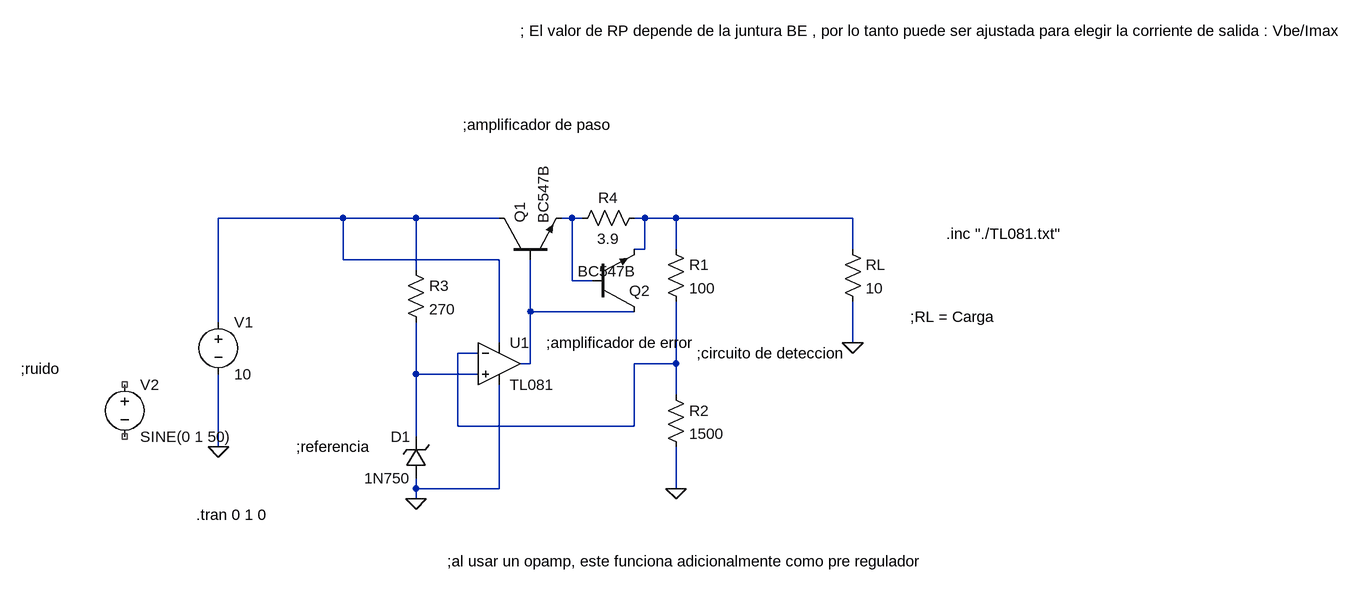
[diagram p0: schematic Fuente.asc]
Fuente.asc, the LTspice schematic file:
Version 4
SHEET 1 1444 680
WIRE -160 -48 -352 -48
WIRE -48 -48 -160 -48
WIRE 80 -48 -48 -48
WIRE 192 -48 176 -48
WIRE 208 -48 192 -48
WIRE 304 -48 288 -48
WIRE 352 -48 304 -48
WIRE 624 -48 352 -48
WIRE 304 0 304 -48
WIRE 304 0 288 0
WIRE 352 0 352 -48
WIRE 624 0 624 -48
WIRE -160 16 -160 -48
WIRE 80 16 -160 16
WIRE -48 32 -48 -48
WIRE 192 48 192 -48
WIRE 224 48 192 48
WIRE 128 96 128 16
WIRE 288 96 128 96
WIRE -352 112 -352 -48
WIRE 80 144 80 16
WIRE 624 144 624 80
WIRE 48 160 16 160
WIRE 128 176 128 96
WIRE 128 176 112 176
WIRE 352 176 352 80
WIRE 352 176 288 176
WIRE -48 192 -48 112
WIRE 48 192 -48 192
WIRE 352 224 352 176
WIRE 16 272 16 160
WIRE 288 272 288 176
WIRE 288 272 16 272
WIRE -48 288 -48 192
WIRE -352 304 -352 192
WIRE -48 368 -48 352
WIRE 80 368 80 208
WIRE 80 368 -48 368
WIRE 352 368 352 304
WIRE -48 384 -48 368
FLAG -352 304 0
FLAG -48 384 0
FLAG 352 368 0
FLAG 624 144 0
SYMBOL npn 80 16 R270
SYMATTR InstName Q1
SYMATTR Value BC547B
SYMBOL res 336 -16 R0
SYMATTR InstName R1
SYMATTR Value 100
SYMBOL res 336 208 R0
SYMATTR InstName R2
SYMATTR Value 1500
SYMBOL res -64 16 R0
SYMATTR InstName R3
SYMATTR Value 270
SYMBOL zener -32 352 R180
WINDOW 0 24 64 Left 2
WINDOW 3 24 0 Left 2
SYMATTR InstName D1
SYMATTR Value 1N750
SYMBOL voltage -352 96 R0
WINDOW 123 0 0 Left 0
WINDOW 39 0 0 Left 0
SYMATTR InstName V1
SYMATTR Value 10
SYMBOL voltage -496 192 R0
WINDOW 123 0 0 Left 0
WINDOW 39 0 0 Left 0
SYMATTR InstName V2
SYMATTR Value SINE(0 1 50)
SYMBOL Opamps\\opamp2 80 112 R0
SYMATTR InstName U1
SYMATTR Value TL081
SYMBOL res 608 -16 R0
SYMATTR InstName RL
SYMATTR Value 10
SYMBOL npn 224 96 M180
WINDOW 3 -23 62 Left 2
SYMATTR InstName Q2
SYMATTR Value BC547B
SYMBOL res 304 -64 R90
WINDOW 0 0 56 VBottom 2
WINDOW 3 32 56 VTop 2
SYMATTR InstName R4
SYMATTR Value 3.9
TEXT -386 408 Left 2 !.tran 0 1 0
TEXT 768 -24 Left 2 !.inc "./TL081.txt"
TEXT 712 104 Left 2 !;RL = Carga
TEXT 112 -336 Left 2 !; El valor de RP depende de la juntura BE , por lo tanto puede ser ajustada para elegir la corriente de salida : Vbe/Imax
TEXT 384 160 Left 2 !;circuito de deteccion
TEXT -232 304 Left 2 !;referencia
TEXT 0 480 Left 2 !;al usar un opamp, este funciona adicionalmente como pre regulador
TEXT 24 -192 Left 2 !;amplificador de paso
TEXT 152 144 Left 2 !;amplificador de error
TEXT -656 184 Left 2 !;ruido

The netlist it stands for:
* Fuente.asc
Q1 N001 N004 N002 0 BC547B
R1 N003 N005 100
R2 N005 0 1500
R3 N001 N006 270
D1 0 N006 1N750
V1 N001 0 10
V2 NC_01 NC_02 SINE(0 1 50)
XU1 N006 N005 N001 0 N004 TL081  ; pins In+ In- V+ V- OUT
RL N003 0 10
Q2 N004 N002 N003 0 BC547B
R4 N003 N002 3.9
.model D D
.lib standard.dio
.model NPN NPN
.model PNP PNP
.lib standard.bjt
.tran 0 1 0
.inc "./TL081.txt"
;RL = Carga
; El valor de RP depende de la juntura BE , por lo tanto puede ser ajustada para elegir la corriente de salida : Vbe/Imax
;circuito de deteccion
;referencia
;al usar un opamp, este funciona adicionalmente como pre regulador
;amplificador de paso
;amplificador de error
;ruido
.backanno
.end